# EAGLE design mouthbrain (EAGLE 6.4)

## Sheet 1 of 2
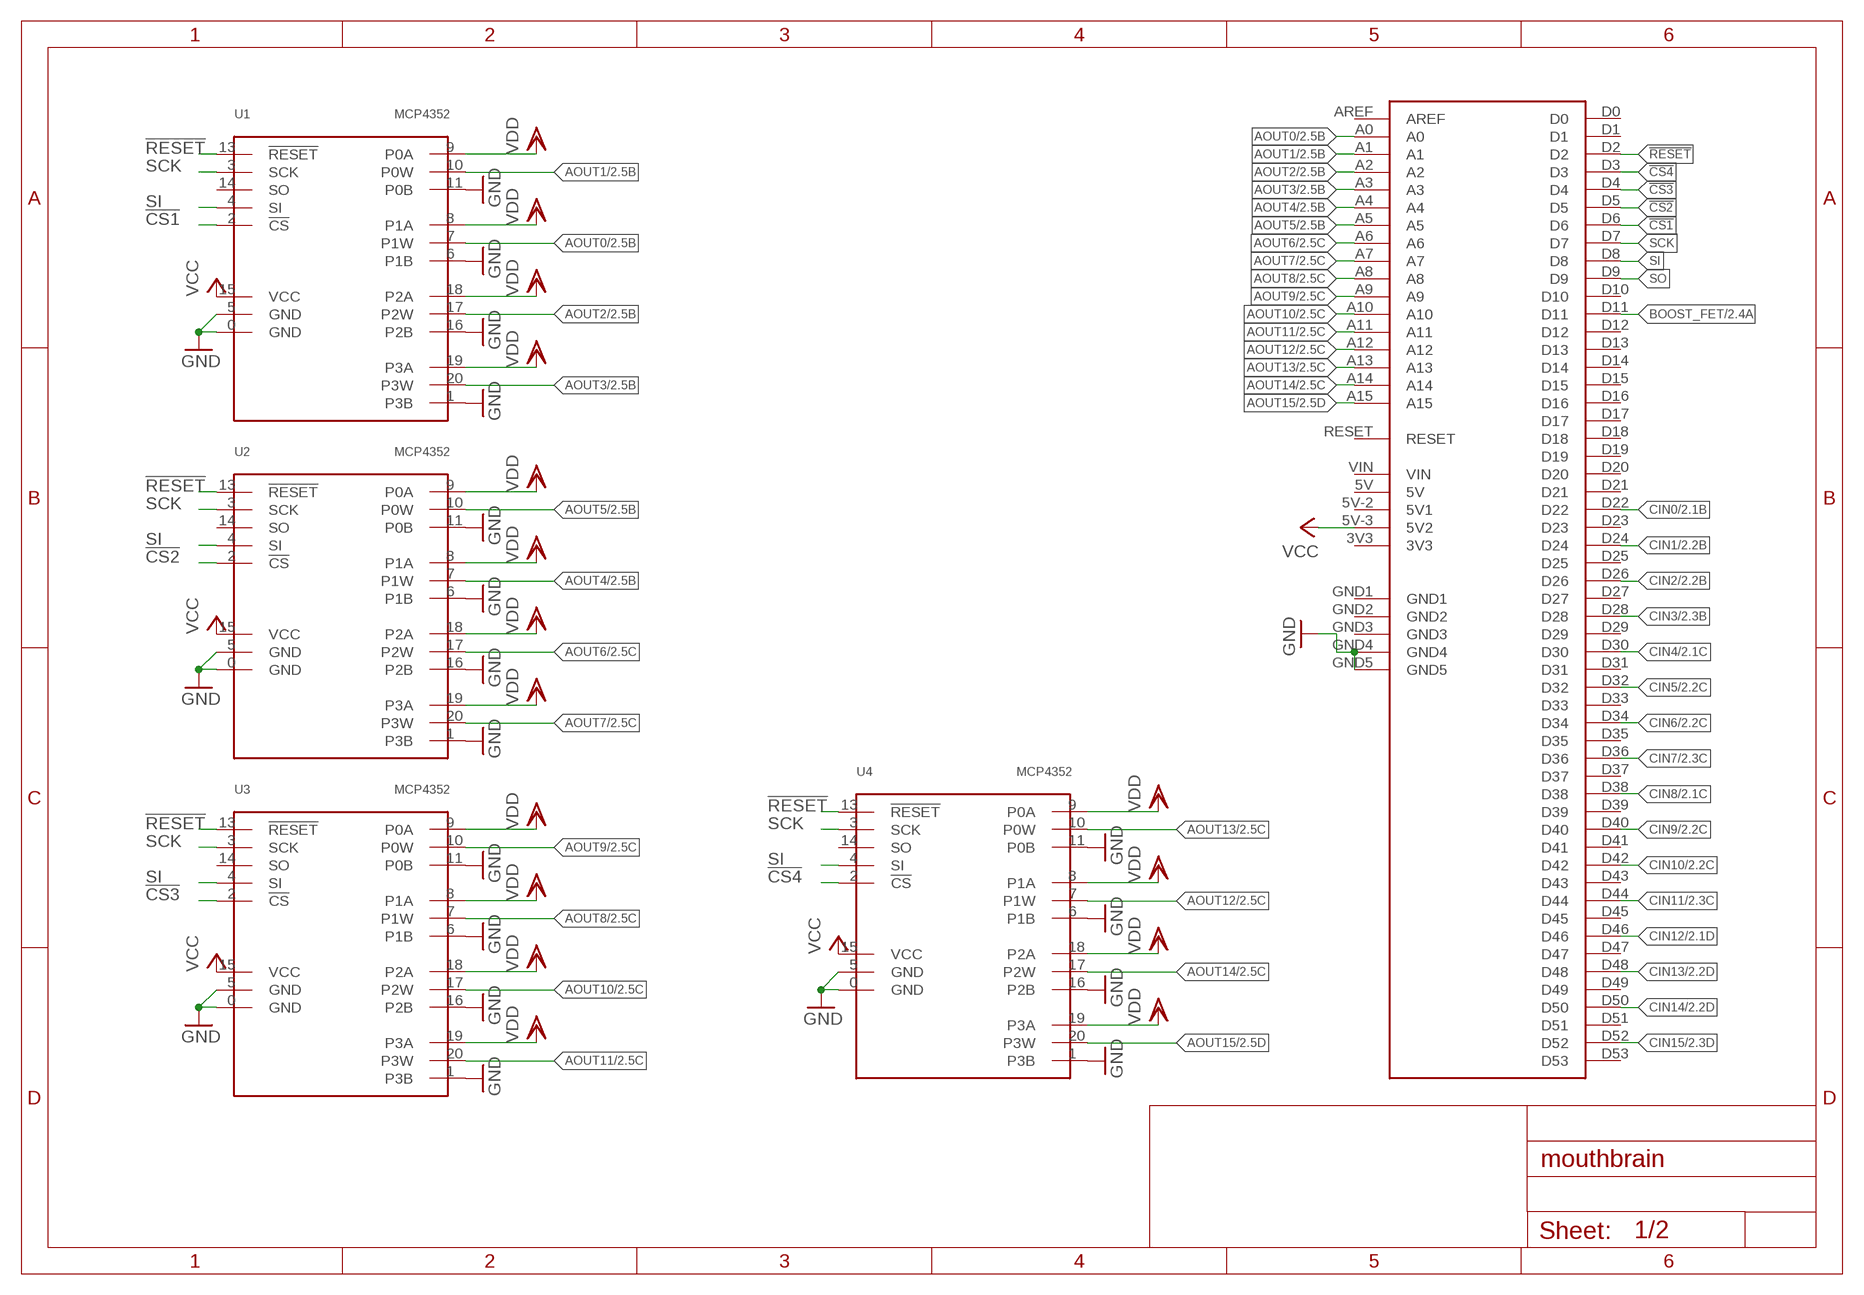
[diagram p0: schematic, sheet 1]

### Parts
U1  MCP4352  [QFN-20-PAD]
U2  MCP4352  [QFN-20-PAD]
U3  MCP4352  [QFN-20-PAD]
U4  MCP4352  [QFN-20-PAD]
U$3  ARDUINO-MEGA  [ARDUINO-MEGA]

### Nets
!CS1: U1.2(!CS) U$3.D6
!CS2: U2.2(!CS) U$3.D5
!CS3: U3.2(!CS) U$3.D4
!CS4: U4.2(!CS) U$3.D3
!RESET: U1.13(!RESET) U2.13(!RESET) U3.13(!RESET) U4.13(!RESET) U$3.D2
AOUT0: U1.7(P1W) U$3.A0 ; also sheet 2
AOUT1: U1.10(P0W) U$3.A1 ; also sheet 2
AOUT2: U1.17(P2W) U$3.A2 ; also sheet 2
AOUT3: U1.20(P3W) U$3.A3 ; also sheet 2
AOUT4: U2.7(P1W) U$3.A4 ; also sheet 2
AOUT5: U2.10(P0W) U$3.A5 ; also sheet 2
AOUT6: U2.17(P2W) U$3.A6 ; also sheet 2
AOUT7: U2.20(P3W) U$3.A7 ; also sheet 2
AOUT8: U3.7(P1W) U$3.A8 ; also sheet 2
AOUT9: U3.10(P0W) U$3.A9 ; also sheet 2
AOUT10: U3.17(P2W) U$3.A10 ; also sheet 2
AOUT11: U3.20(P3W) U$3.A11 ; also sheet 2
AOUT12: U4.7(P1W) U$3.A12 ; also sheet 2
AOUT13: U4.10(P0W) U$3.A13 ; also sheet 2
AOUT14: U4.17(P2W) U$3.A14 ; also sheet 2
AOUT15: U4.20(P3W) U$3.A15 ; also sheet 2
BOOST_FET: U$3.D11 ; also sheet 2
CIN0: U$3.D22 ; also sheet 2
CIN1: U$3.D24 ; also sheet 2
CIN2: U$3.D26 ; also sheet 2
CIN3: U$3.D28 ; also sheet 2
CIN4: U$3.D30 ; also sheet 2
CIN5: U$3.D32 ; also sheet 2
CIN6: U$3.D34 ; also sheet 2
CIN7: U$3.D36 ; also sheet 2
CIN8: U$3.D38 ; also sheet 2
CIN9: U$3.D40 ; also sheet 2
CIN10: U$3.D42 ; also sheet 2
CIN11: U$3.D44 ; also sheet 2
CIN12: U$3.D46 ; also sheet 2
CIN13: U$3.D48 ; also sheet 2
CIN14: U$3.D50 ; also sheet 2
CIN15: U$3.D52 ; also sheet 2
GND: U1.0(GND) U1.1(P3B) U1.5(GND) U1.6(P1B) U1.11(P0B) U1.16(P2B) U2.0(GND) U2.1(P3B) U2.5(GND) U2.6(P1B) U2.11(P0B) U2.16(P2B) U3.0(GND) U3.1(P3B) U3.5(GND) U3.6(P1B) U3.11(P0B) U3.16(P2B) U4.0(GND) U4.1(P3B) U4.5(GND) U4.6(P1B) U4.11(P0B) U4.16(P2B) U$3.GND4 U$3.GND5 ; also sheet 2
SCK: U1.3(SCK) U2.3(SCK) U3.3(SCK) U4.3(SCK) U$3.D7
SI: U1.4(SI) U2.4(SI) U3.4(SI) U4.4(SI) U$3.D8
SO: U$3.D9
VCC: U1.15(VCC) U2.15(VCC) U3.15(VCC) U4.15(VCC) U$3.5V-3(5V2) ; also sheet 2
VDD: U1.8(P1A) U1.9(P0A) U1.18(P2A) U1.19(P3A) U2.8(P1A) U2.9(P0A) U2.18(P2A) U2.19(P3A) U3.8(P1A) U3.9(P0A) U3.18(P2A) U3.19(P3A) U4.8(P1A) U4.9(P0A) U4.18(P2A) U4.19(P3A) ; also sheet 2
Unconnected: U1.14(SO) U2.14(SO) U3.14(SO) U4.14(SO) U$3.3V3 U$3.5V U$3.5V-2(5V1) U$3.AREF U$3.D0 U$3.D1 U$3.D10 U$3.D12 U$3.D13 U$3.D14 U$3.D15 U$3.D16 U$3.D17 U$3.D18 U$3.D19 U$3.D20 U$3.D21 U$3.D23 U$3.D25 U$3.D27 U$3.D29 U$3.D31 U$3.D33 U$3.D35 U$3.D37 U$3.D39 U$3.D41 U$3.D43 U$3.D45 U$3.D47 U$3.D49 U$3.D51 U$3.D53 U$3.GND1 U$3.GND2 U$3.GND3 U$3.RESET U$3.VIN

## Sheet 2 of 2
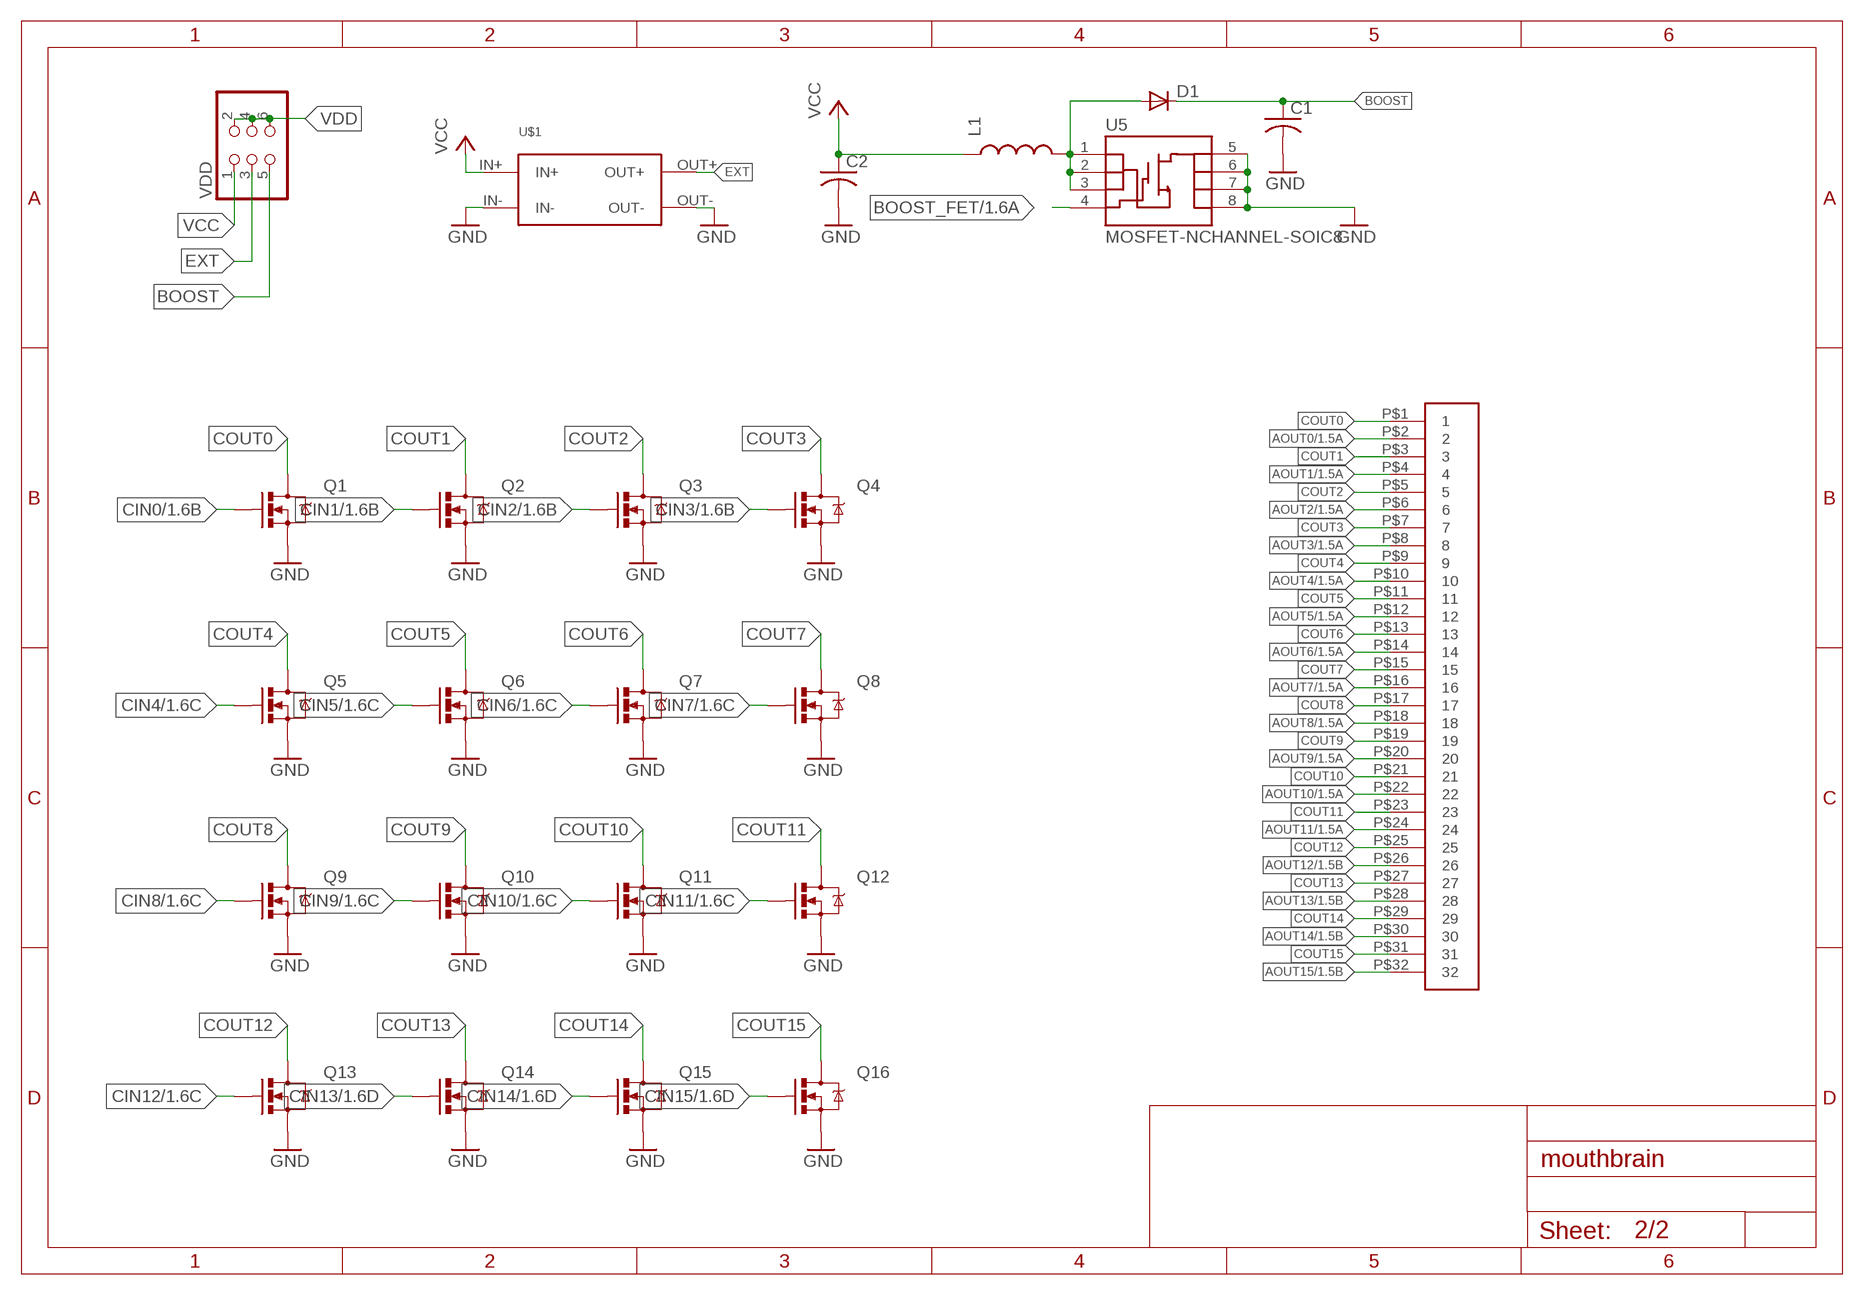
[diagram p1: schematic, sheet 2]

### Parts
C1  C-USC1206  [C1206]
C2  C-USC1206  [C1206]
D1  DIODESMA  [SMA-DIODE]
L1  INDUCTOR1206H*  [INDUCTOR-1206]
Q1  MOSFET-NCHANNELSMD  [SOT23-3]
Q2  MOSFET-NCHANNELSMD  [SOT23-3]
Q3  MOSFET-NCHANNELSMD  [SOT23-3]
Q4  MOSFET-NCHANNELSMD  [SOT23-3]
Q5  MOSFET-NCHANNELSMD  [SOT23-3]
Q6  MOSFET-NCHANNELSMD  [SOT23-3]
Q7  MOSFET-NCHANNELSMD  [SOT23-3]
Q8  MOSFET-NCHANNELSMD  [SOT23-3]
Q9  MOSFET-NCHANNELSMD  [SOT23-3]
Q10  MOSFET-NCHANNELSMD  [SOT23-3]
Q11  MOSFET-NCHANNELSMD  [SOT23-3]
Q12  MOSFET-NCHANNELSMD  [SOT23-3]
Q13  MOSFET-NCHANNELSMD  [SOT23-3]
Q14  MOSFET-NCHANNELSMD  [SOT23-3]
Q15  MOSFET-NCHANNELSMD  [SOT23-3]
Q16  MOSFET-NCHANNELSMD  [SOT23-3]
U5  MOSFET-NCHANNEL-SOIC8  [SO08]
U$1  DC-DC-CONVERTER  [DC-DC-MODULE]
U$2  FPC-0.5-32HORIZ  [FPC-32-HORIZONTAL]
VDD  PINHD-2X3  [2X03]

### Nets
AOUT0: U$2.P$2 ; also sheet 1
AOUT1: U$2.P$4 ; also sheet 1
AOUT2: U$2.P$6 ; also sheet 1
AOUT3: U$2.P$8 ; also sheet 1
AOUT4: U$2.P$10 ; also sheet 1
AOUT5: U$2.P$12 ; also sheet 1
AOUT6: U$2.P$14 ; also sheet 1
AOUT7: U$2.P$16 ; also sheet 1
AOUT8: U$2.P$18 ; also sheet 1
AOUT9: U$2.P$20 ; also sheet 1
AOUT10: U$2.P$22 ; also sheet 1
AOUT11: U$2.P$24 ; also sheet 1
AOUT12: U$2.P$26 ; also sheet 1
AOUT13: U$2.P$28 ; also sheet 1
AOUT14: U$2.P$30 ; also sheet 1
AOUT15: U$2.P$32 ; also sheet 1
BOOST: C1.1 D1.C VDD.5
BOOST_FET: U5.4(G) ; also sheet 1
CIN0: Q1.1(G) ; also sheet 1
CIN1: Q2.1(G) ; also sheet 1
CIN2: Q3.1(G) ; also sheet 1
CIN3: Q4.1(G) ; also sheet 1
CIN4: Q5.1(G) ; also sheet 1
CIN5: Q6.1(G) ; also sheet 1
CIN6: Q7.1(G) ; also sheet 1
CIN7: Q8.1(G) ; also sheet 1
CIN8: Q9.1(G) ; also sheet 1
CIN9: Q10.1(G) ; also sheet 1
CIN10: Q11.1(G) ; also sheet 1
CIN11: Q12.1(G) ; also sheet 1
CIN12: Q13.1(G) ; also sheet 1
CIN13: Q14.1(G) ; also sheet 1
CIN14: Q15.1(G) ; also sheet 1
CIN15: Q16.1(G) ; also sheet 1
COUT0: Q1.3(D) U$2.P$1
COUT1: Q2.3(D) U$2.P$3
COUT2: Q3.3(D) U$2.P$5
COUT3: Q4.3(D) U$2.P$7
COUT4: Q5.3(D) U$2.P$9
COUT5: Q6.3(D) U$2.P$11
COUT6: Q7.3(D) U$2.P$13
COUT7: Q8.3(D) U$2.P$15
COUT8: Q9.3(D) U$2.P$17
COUT9: Q10.3(D) U$2.P$19
COUT10: Q11.3(D) U$2.P$21
COUT11: Q12.3(D) U$2.P$23
COUT12: Q13.3(D) U$2.P$25
COUT13: Q14.3(D) U$2.P$27
COUT14: Q15.3(D) U$2.P$29
COUT15: Q16.3(D) U$2.P$31
EXT: U$1.OUT+ VDD.3
GND: C1.2 C2.2 Q1.2(S) Q2.2(S) Q3.2(S) Q4.2(S) Q5.2(S) Q6.2(S) Q7.2(S) Q8.2(S) Q9.2(S) Q10.2(S) Q11.2(S) Q12.2(S) Q13.2(S) Q14.2(S) Q15.2(S) Q16.2(S) U5.5(D) U5.6(D) U5.7(D) U5.8(D) U$1.IN- U$1.OUT- ; also sheet 1
N$1: D1.A L1.P$2 U5.1(S) U5.2(S) U5.3(S)
VCC: C2.1 L1.P$1 U$1.IN+ VDD.1 ; also sheet 1
VDD: VDD.2 VDD.4 VDD.6 ; also sheet 1

## Library data of the parts
C1 C2 = rcl:C-US: CAPACITOR, American symbol
D1 = SparkFun:DIODE: Diode These are standard reverse protection diodes and small signal diodes. SMA package can handle up to about 1A. SOD-323 can handle about 200mA. What the SOD-323 package when ordering, there are some mfgs out there that are 5-pin packages.
L1 = SparkFun:INDUCTOR: Inductors Basic Inductor/Choke - 0603 and 1206. Footprints are not proven and vary greatly between part numbers.
Q1-Q16 = SparkFun:MOSFET-NCHANNEL
U1-U4 = mouthbrain:MCP4352
U5 = SparkFun:MOSFET-NCHANNEL-SOIC8: N-Channel MOSFET IRF9410 and NDS8434 are common, SOIC-8 parts.
U$1 = Hoektronics:DC-DC-CONVERTER
U$2 = Hoektronics:FPC-0.5-32
U$3 = Hoektronics:ARDUINO-MEGA
VDD = pinhead:PINHD-2X3: PIN HEADER

## Board
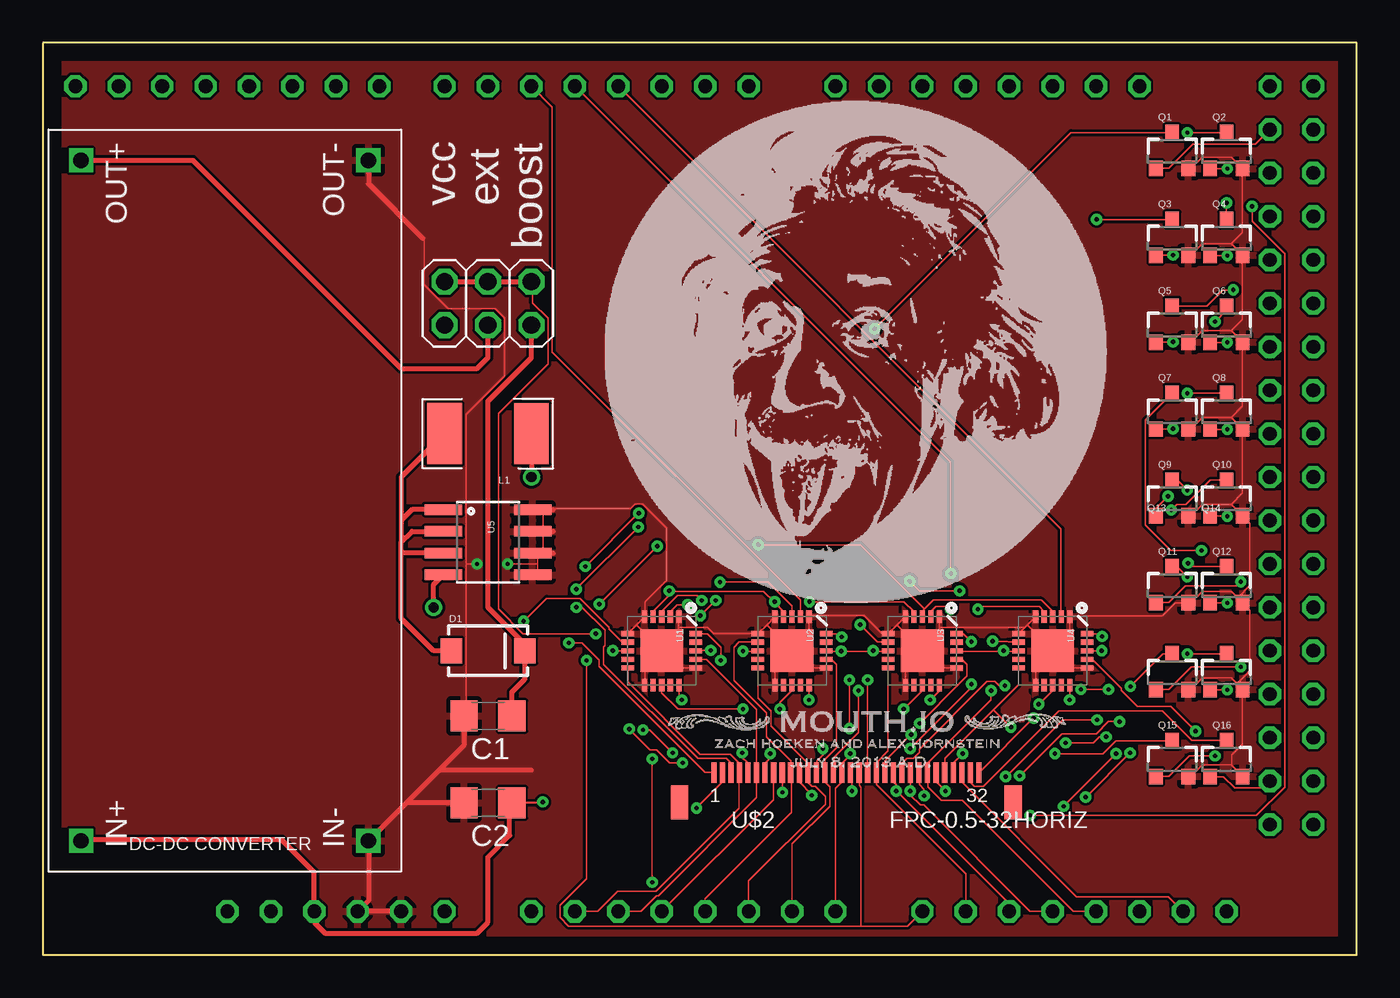
[diagram p2: board, top side]
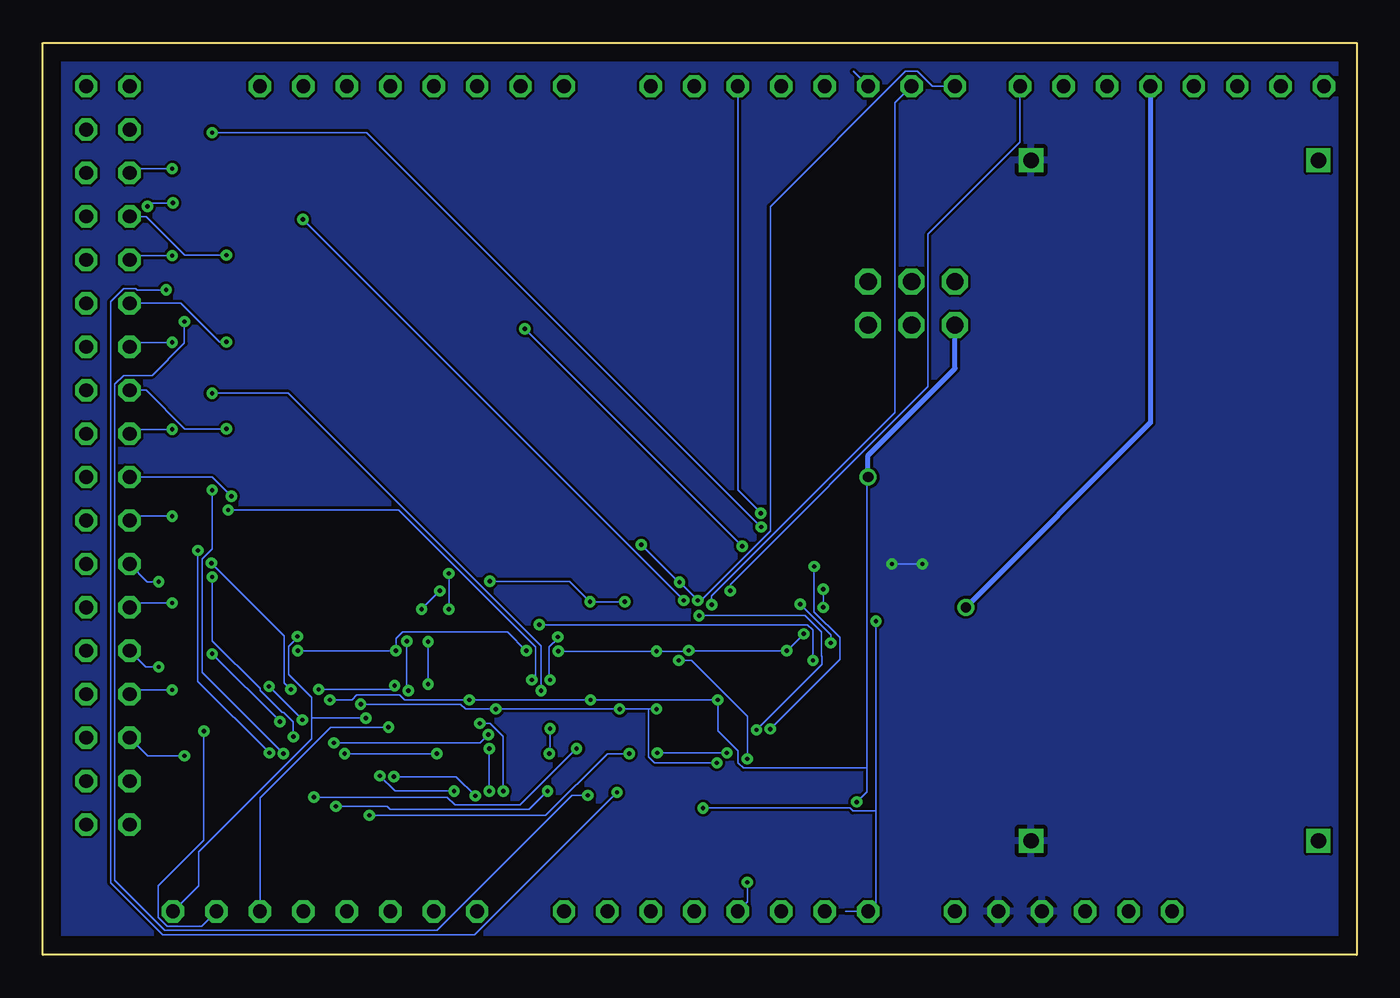
[diagram p3: board, bottom side, seen from below]

Size 76.83 x 53.34 mm. Coordinates in mm from the lower left corner, seen from the top.
Outline: 0,0 76.83,0 76.83,53.34 0,53.34 0,0
Copper layers (1*16): Top 0.035mm / dielectric 1.5mm / Bottom 0.035mm
Design rules "default *": minimum track width 4mil, minimum drill 10mil, track to track 6mil, track to pad 6mil, pad to pad 6mil, via to via 6mil, smd to smd 6mil, copper to edge 40mil, drill to drill 8mil, minimum pad ring 10mil, minimum via ring 8mil, stop-mask expansion 4mil, vias tented up to drill 15mil, thermal gap 10mil

### Footprints (pad centres in the part's own frame; a part is rotated, then mirrored left to right if it is on the bottom)
C1206 = smd 1.6 x 1.8: 1 -1.4,0; 2 1.4,0
SMA-DIODE = smd 1.27 x 1.47: A -2.15,0; C 2.15,0
INDUCTOR-1206 = smd 2.032 x 3.556: P$1 -2.54,0; P$2 2.54,0
SOT23-3 = smd 0.8 x 0.9: 1 -0.95,-1; 2 0.95,-1; 3 0,1.1
QFN-20-PAD = smd 2.5 x 2.5: 0 0,0 | smd 0.73 x 0.3: 1 -2,1; 2 -2,0.5; 3 -2,0; 4 -2,-0.5; 5 -2,-1; 11 2,-1; 12 2,-0.5; 13 2,0; 14 2,0.5; 15 2,1 | smd 0.3 x 0.73: 6 -1,-2; 7 -0.5,-2; 8 0,-2; 9 0.5,-2; 10 1,-2; 16 1,2; 17 0.5,2; 18 0,2; 19 -0.5,2; 20 -1,2
SO08 = smd 0.61 x 2.21: 1 -1.905,-2.616; 2 -0.635,-2.616; 3 0.635,-2.616; 4 1.905,-2.616; 5 1.905,2.616; 6 0.635,2.616; 7 -0.635,2.616; 8 -1.905,2.616
DC-DC-MODULE = drill 0.9 square: IN+ -19.9,8.4; IN- -19.9,-8.4; OUT+ 19.9,8.4; OUT- 19.9,-8.4
FPC-32-HORIZONTAL = smd 0.3 x 1.2: P$1 -7.75,0.5; P$2 -7.25,0.5; P$3 -6.75,0.5; P$4 -6.25,0.5; P$5 -5.75,0.5; P$6 -5.25,0.5; P$7 -4.75,0.5; P$8 -4.25,0.5; P$9 -3.75,0.5; P$10 -3.25,0.5; P$11 -2.75,0.5; P$12 -2.25,0.5; P$13 -1.75,0.5; P$14 -1.25,0.5; P$15 -0.75,0.5; P$16 -0.25,0.5; P$17 0.25,0.5; P$18 0.75,0.5; P$19 1.25,0.5; P$20 1.75,0.5; P$21 2.25,0.5; P$22 2.75,0.5; P$23 3.25,0.5; P$24 3.75,0.5; P$25 4.25,0.5; P$26 4.75,0.5; P$27 5.25,0.5; P$28 5.75,0.5; P$29 6.25,0.5; P$30 6.75,0.5; P$31 7.25,0.5; P$32 7.75,0.5 | smd 1 x 2: P$33 -9.75,-1.25; P$34 9.75,-1.25
ARDUINO-MEGA = drill 0.8 octagon: 3V3 35.56,2.54; 5V 93.98,50.8; 5V-2 96.52,50.8; 5V-3 38.1,2.54; A0 50.8,2.54; A1 53.34,2.54; A2 55.88,2.54; A3 58.42,2.54; A4 60.96,2.54; A5 63.5,2.54; A6 66.04,2.54; A7 68.58,2.54; A8 73.66,2.54; A9 76.2,2.54; A10 78.74,2.54; A11 81.28,2.54; A12 83.82,2.54; A13 86.36,2.54; A14 88.9,2.54; A15 91.44,2.54; AREF 24.13,50.8; D0 63.5,50.8; D1 60.96,50.8; D2 58.42,50.8; D3 55.88,50.8; D4 53.34,50.8; D5 50.8,50.8; D6 48.26,50.8; D7 45.72,50.8; D8 41.91,50.8; D9 39.37,50.8; D10 36.83,50.8; D11 34.29,50.8; D12 31.75,50.8; D13 29.21,50.8; D14 68.58,50.8; D15 71.12,50.8; D16 73.66,50.8; D17 76.2,50.8; D18 78.74,50.8; D19 81.28,50.8; D20 83.82,50.8; D21 86.36,50.8; D22 93.98,48.26; D23 96.52,48.26; D24 93.98,45.72; D25 96.52,45.72; D26 93.98,43.18; D27 96.52,43.18; D28 93.98,40.64; D29 96.52,40.64; D30 93.98,38.1; D31 96.52,38.1; D32 93.98,35.56; D33 96.52,35.56; D34 93.98,33.02; D35 96.52,33.02; D36 93.98,30.48; D37 96.52,30.48; D38 93.98,27.94; D39 96.52,27.94; D40 93.98,25.4; D41 96.52,25.4; D42 93.98,22.86; D43 96.52,22.86; D44 93.98,20.32; D45 96.52,20.32; D46 93.98,17.78; D47 96.52,17.78; D48 93.98,15.24; D49 96.52,15.24; D50 93.98,12.7; D51 96.52,12.7; D52 93.98,10.16; D53 96.52,10.16; GND1 26.67,50.8; GND2 93.98,7.62; GND3 96.52,7.62; GND4 40.64,2.54; GND5 43.18,2.54; RESET 33.02,2.54; VIN 45.72,2.54
2X03 = drill 1.016 octagon: 1 -2.54,-1.27; 2 -2.54,1.27; 3 0,-1.27; 4 0,1.27; 5 2.54,-1.27; 6 2.54,1.27

### Placement (x,y rotation side)
C1  26.04,13.97 180 top
C2  26.04,8.89 180 top
D1  26.04,17.78 0 top
L1  26.04,30.48 180 top
Q1  66.04,46.99 0 top
Q2  69.22,46.99 0 top
Q3  66.04,41.91 0 top
Q4  69.22,41.91 0 top
Q5  66.04,36.83 0 top
Q6  69.22,36.83 0 top
Q7  66.04,31.75 0 top
Q8  69.22,31.75 0 top
Q9  66.04,26.67 0 top
Q10  69.22,26.67 0 top
Q11  66.04,21.59 0 top
Q12  69.22,21.59 0 top
Q13  66.04,16.51 0 top
Q14  69.22,16.51 0 top
Q15  66.04,11.43 0 top
Q16  69.22,11.43 0 top
U1  36.2,17.78 270 top
U2  43.81,17.78 270 top
U3  51.44,17.78 270 top
U4  59.05,17.78 270 top
U5  26.04,24.13 270 top
U$1  10.64,26.57 90 top
U$2  46.99,10.16 0 top
U$3  -22.23,0 0 top
VDD  26.04,38.1 0 top

### Tracks (layer width: path | path; a pad name or v marks a point on that pad's centre or on a via)
!CS1  (via drill 0.25)
  Top 0.102: v37.72,20.47 37.08,20.47 36.7,20.09 U1.2
  Bottom 0.102: v37.72,20.47 37.72,20.98 27,31.7 27,49.84 U$3.D6
!CS2
  Top 0.102: U$3.D5 29.79,49.58 29.79,35.26 44.3,20.75 44.3,19.79 U2.2
  Bottom 0.102: U$3.D5 29.44,51.66
!CS3  (via drill 0.25)
  Top 0.102: v53.09,20.22 52.93,20.37 52.22,20.37 51.94,20.09 U3.2 | v53.09,22.3 53.09,28.83 U$3.D4
  Bottom 0.102: v53.09,22.3 v53.09,20.22
!CS4
  Top 0.102: U$3.D3 59.54,24.92 59.54,19.79 U4.2
!RESET  (via drill 0.25)
  Top 0.102: U1.13 36.2,15.32 37.13,14.38 v40.95,14.38 | v43.1,14.38 43.1,14.76 43.81,15.47 U2.13 | U3.13 51.44,15.47 v50.34,14.38 | U4.13 59.05,15.47 v58.24,14.66 | v31.73,22.71 v34.85,25.83 | v34.29,13.21 35.51,11.99 35.89,11.99 36.65,11.23 v37.41,11.23
  Bottom 0.102: 41.43,14.38 v43.1,14.38 v50.34,14.38 52.12,14.38 52.4,14.66 v58.24,14.66 | 41.43,14.38 v40.95,14.38 | U$3.D2 36.2,27.18 v34.85,25.83 | v31.73,22.71 31.73,20.07 30.23,18.57 30.23,17.27 v34.29,13.21 | v37.41,11.23 41.07,11.23 41.43,11.58 41.43,14.38
AOUT0  (via drill 0.25)
  Top 0.102: v28.12,19.51 29.46,20.85 31.42,20.85 33.12,19.15 33.12,19.05 33.88,18.29 34.19,18.29 U1.7 | v38.23,8.59 39.73,10.08 39.73,10.64 U$2.P$2
  Bottom 0.102: 29.9,2.54 U$3.A0 28.12,3 28.12,8.41 | 28.12,8.41 v28.12,19.51 | v38.23,8.59 29.64,8.59 29.46,8.41 28.12,8.41
AOUT1
  Top 0.102: U1.10 34.21,16.76 34.21,15.95 38.43,11.73 40.21,11.73 40.72,11.23 40.72,10.67 U$2.P$4 40.72,10.62 40.72,8.56 35.87,3.71 33.6,3.71 32.44,2.54 U$3.A1
AOUT2
  Top 0.102: U1.17 38.81,17.27 41.73,14.35 U$2.P$6 41.73,10.62 41.73,9.2 35.99,3.45 35.89,3.45 34.98,2.54 U$3.A2
AOUT3  (via drill 0.25)
  Top 0.102: v39.65,17.22 39.65,17.98 38.86,18.77 U1.20 | v35.64,4.24 v35.64,11.46 | U$3.A3 42.72,9.07 42.72,10.64 U$2.P$8
  Bottom 0.102: v39.65,17.22 38.91,17.22 35.64,13.95 v35.64,11.46 | v35.64,4.24 35.64,3.1 U$3.A3
AOUT4
  Top 0.102: U2.7 40.72,18.29 40.41,17.98 40.41,16.05 42.32,14.15 42.32,12.75 43.74,11.33 U$2.P$10 43.79,10.64 43.79,8.33 38.73,3.28 U$3.A4
AOUT5
  Top 0.102: U2.10 41.83,16.76 41.83,15.01 42.57,14.28 42.57,13.39 44.73,11.23 44.73,10.67 U$2.P$12 44.76,10.62 44.76,10.08 44.98,9.86 45.19,9.86 45.77,9.27 45.77,8.81 41.27,4.32 U$3.A5
AOUT6
  Top 0.102: U2.17 45.82,17.27 46.13,17.27 46.41,16.99 46.41,12.09 45.74,11.43 U$2.P$14 45.77,10.62 45.77,10.08 46.02,9.83 46.02,8.69 43.81,6.48 U$3.A6
AOUT7  (via drill 0.25)
  Top 0.102: v46.71,18.59 46.53,18.77 45.82,18.77 U2.20 | v47.17,13.23 v47.17,16.08 | v47.22,11.76 47.22,11.68 46.76,11.23 46.76,10.67 U$2.P$16 46.74,10.62 46.74,10.11 46.35,9.73 U$3.A7
  Bottom 0.102: v46.71,18.59 46.71,18.52 47.22,18.01 47.22,16.13 v47.17,16.08 | v47.17,13.23 47.17,11.81 v47.22,11.76
AOUT8  (via drill 0.25)
  Top 0.102: v47.8,19.3 48.82,18.29 49.43,18.29 U3.7 | v31.8,17.22 31.8,4.45 30.25,2.9 30.25,2.18 30.76,1.68 47.85,1.68 | 47.85,1.68 50.57,1.68 U$3.A8 | 47.85,1.68 47.85,9.8 47.75,9.91 47.75,10.64 U$2.P$18
  Bottom 0.102: v47.8,19.3 32.11,19.3 31.8,19 v31.8,17.22
AOUT9
  Top 0.102: U3.10 49.43,16.76 49.43,11.91 48.74,11.23 U$2.P$20 48.74,10.62 48.74,9.98 53.98,4.75 U$3.A9
AOUT10  (via drill 0.25)
  Top 0.102: v51.28,13.54 52.43,14.68 52.43,14.71 54.03,16.31 54.03,16.99 53.75,17.27 U3.17 | U$2.P$22 49.76,10.64 49.76,10.08 49.91,9.93 v49.91,9.58 56.52,2.97 U$3.A10
  Bottom 0.102: v51.28,13.54 50.67,13.54 49.91,12.78 v49.91,9.58
AOUT11  (via drill 0.25)
  Top 0.102: v54.3,18.31 53.85,18.77 U3.20 | v54.3,15.82 54.3,15.65 v50.72,12.06 | U$2.P$24 50.72,10.64 v50.72,9.58 50.75,9.55 50.75,9.32 51.31,8.76 51.51,8.76 57.73,2.54 U$3.A11
  Bottom 0.102: v54.3,15.82 v54.3,18.31 | v50.72,9.58 v50.72,12.06
AOUT12  (via drill 0.25)
  Top 0.102: v55.55,18.34 56.41,18.34 56.46,18.29 U4.7 | v55.45,15.44 55.45,14.91 51.77,11.23 51.77,10.67 U$2.P$26 51.77,10.62 51.77,9.83 52.55,9.04 53.77,9.04 60.27,2.54 U$3.A12
  Bottom 0.102: v55.55,18.34 55.55,15.54 v55.45,15.44
AOUT13  (via drill 0.25)
  Top 0.102: 55.6,14.33 52.76,11.48 52.76,10.67 U$2.P$28 | 55.6,14.33 57.05,15.77 57.05,16.76 U4.10 | 55.6,14.33 v56.62,13.31
  Bottom 0.102: U$3.A13 64.14,9.17 59.99,13.31 v56.62,13.31
AOUT14  (via drill 0.25)
  Top 0.102: v67.41,13.08 65.96,14.53 64.01,14.53 63.07,15.47 63.07,15.57 61.37,17.27 61.06,17.27 U4.17 | U$3.A14 65.81,3.4 60.45,3.4 53.75,10.11 53.75,10.64 U$2.P$30
  Bottom 0.102: v67.41,13.08 67.41,6.71 70.08,4.04 70.08,2.18 69.57,1.68 67.54,1.68 U$3.A14
AOUT15  (via drill 0.25)
  Top 0.102: v61.95,18.62 61.8,18.77 61.06,18.77 U4.20 | v57.94,13.84 54.76,10.67 U$2.P$32
  Bottom 0.102: v61.95,18.62 61.95,18.54 62.46,18.03 62.46,16.41 61.11,15.06 61.11,13.84 | 61.11,13.84 61.11,12.62 67.72,6.02 67.72,4.04 U$3.A15 | 61.11,13.84 v57.94,13.84
BOOST
  Top 0.305: C1.1 27.43,15.37 28.18,16.12 D1.C 28.18,18.17 26.04,20.32 26.04,32.38 28.57,34.92 VDD.5
BOOST_FET  (via drill 0.6)
  Top 0.305: v22.86,20.32 22.86,21.67 U5.4
  Bottom 0.305: U$3.D11 12.06,31.11 v22.86,20.32
CIN0
  Top 0.102: U$3.D22 70.92,47.42 67.26,47.42 65.84,46 Q1.1
CIN1  (via drill 0.25)
  Top 0.102: v69.27,45.97 68.28,45.97 Q2.1
  Bottom 0.102: v69.27,45.97 71.5,45.97 U$3.D24
CIN2  (via drill 0.25)
  Top 0.102: v66.09,40.92 Q3.1
  Bottom 0.102: v66.09,40.92 68.53,40.92 70.79,43.18 U$3.D26
CIN3  (via drill 0.25)
  Top 0.102: v69.27,40.89 68.28,40.89 Q4.1
  Bottom 0.102: v69.27,40.89 71.5,40.89 U$3.D28
CIN4  (via drill 0.25)
  Top 0.102: v66.09,35.84 Q5.1
  Bottom 0.102: v66.09,35.84 66.5,35.84 68.76,38.1 U$3.D30
CIN5  (via drill 0.25)
  Top 0.102: v69.27,35.81 68.28,35.81 Q6.1
  Bottom 0.102: v69.27,35.81 71.5,35.81 U$3.D32
CIN6  (via drill 0.25)
  Top 0.102: v66.09,30.76 Q7.1
  Bottom 0.102: v66.09,30.76 68.53,30.76 70.79,33.02 U$3.D34
CIN7  (via drill 0.25)
  Top 0.102: v69.27,30.73 68.28,30.73 Q8.1
  Bottom 0.102: v69.27,30.73 71.5,30.73 U$3.D36
CIN8  (via drill 0.25)
  Top 0.102: v65.81,26.82 65.1,26.11 Q9.1
  Bottom 0.102: v65.81,26.82 66.93,27.94 U$3.D38
CIN9  (via drill 0.25)
  Top 0.102: v69.27,25.65 68.28,25.65 Q10.1
  Bottom 0.102: v69.27,25.65 71.5,25.65 U$3.D40
CIN10  (via drill 0.25)
  Top 0.102: v70.05,21.82 69.8,21.57 66.8,21.57 65.84,20.6 Q11.1
  Bottom 0.102: v70.05,21.82 70.71,21.82 U$3.D42
CIN11  (via drill 0.25)
  Top 0.102: v69.27,20.57 68.28,20.57 Q12.1
  Bottom 0.102: v69.27,20.57 71.5,20.57 U$3.D44
CIN12  (via drill 0.25)
  Top 0.102: v70.05,16.84 67.16,16.84 65.84,15.52 Q13.1
  Bottom 0.102: v70.05,16.84 70.81,16.84 U$3.D46
CIN13  (via drill 0.25)
  Top 0.102: v69.27,15.49 68.28,15.49 Q14.1
  Bottom 0.102: v69.27,15.49 71.5,15.49 U$3.D48
CIN14  (via drill 0.25)
  Top 0.102: v68.56,11.63 67.03,11.63 65.84,10.44 Q15.1
  Bottom 0.102: v68.56,11.63 70.69,11.63 U$3.D50
CIN15
  Top 0.102: U$3.D52 71.35,9.75 69.7,9.75 69.04,10.41 68.28,10.41 Q16.1
COUT0  (via drill 0.25)
  Top 0.102: v48.64,36.6 60.12,48.08 Q1.3 | v32.54,20.5 v35.94,23.9 | v30.76,18.24 31.55,18.24 32.54,17.25 32.54,16.87 38.73,10.67 39.22,10.67 U$2.P$1
  Bottom 0.102: v35.94,23.9 v48.64,36.6 | v32.54,20.5 30.76,18.72 v30.76,18.24
COUT1  (via drill 0.25)
  Top 0.102: v66.93,48.08 Q2.3 | v31.19,21.39 v34.82,25.02 | v31.19,20.32 31.55,20.32 32.87,19 32.87,18.09 32.79,18.01 32.79,16.99 38.3,11.48 39.98,11.48 40.23,11.23 U$2.P$3
  Bottom 0.102: v66.93,48.08 57.89,48.08 v34.82,25.02 | v31.19,20.32 v31.19,21.39
COUT2  (via drill 0.25)
  Top 0.102: v61.62,43 Q3.3 | v38.46,19.84 v39.34,20.73 | v35.1,13.16 35.48,13.16 v36.83,11.81 | v40.89,11.81 40.89,11.56 41.22,11.23 41.22,10.67 U$2.P$5
  Bottom 0.102: v39.34,20.73 v61.62,43 | v38.46,19.84 32.26,19.84 31.29,18.87 31.29,17.48 31.27,17.45 31.27,16.99 v35.1,13.16 | v40.89,11.81 v36.83,11.81
COUT3  (via drill 0.25)
  Top 0.102: v69.22,43.97 Q4.3 | v70.71,43.76 70.71,42.9 72.62,41 72.62,9.8 70.97,8.15 v57.73,8.15 | v42.55,11.76 42.55,11.51 42.24,11.2 U$2.P$7
  Bottom 0.102: v69.22,43.97 70.51,43.97 v70.71,43.76 | v57.73,8.15 47.42,8.15 43.81,11.76 v42.55,11.76
COUT4  (via drill 0.25)
  Top 0.102: v69.62,38.89 69.01,38.89 68.07,37.95 66.04,37.95 Q5.3 | v43.26,9.5 43.26,10.64 U$2.P$9
  Bottom 0.102: v69.62,38.89 71.32,38.89 71.4,38.96 72.11,38.96 72.87,38.2 72.87,4.22 69.83,1.17 51.59,1.17 v43.26,9.5
COUT5  (via drill 0.25)
  Top 0.102: Q6.3 69.22,37.69 v68.56,37.03 | v44.96,9.32 44.96,9.4 44.25,10.11 44.25,10.64 U$2.P$11
  Bottom 0.102: v68.56,37.03 68.56,35.76 70.43,33.88 72.11,33.88 72.62,33.38 72.62,4.34 69.7,1.42 53.77,1.42 45.87,9.32 v44.96,9.32
COUT6  (via drill 0.25)
  Top 0.102: v67.77,23.65 65.96,23.65 64.47,25.15 64.47,31.27 Q7.3 | v60.98,9.22 v63.58,11.81 | v45.62,12.06 45.62,11.68 45.26,11.33 45.26,10.67 U$2.P$13
  Bottom 0.102: v67.77,23.65 67.77,16 v63.58,11.81 | v60.98,9.22 53.19,9.22 52.73,8.76 48.92,8.76 v45.62,12.06
COUT7  (via drill 0.25)
  Top 0.102: v66.93,32.84 Q8.3 | v47.7,15.44 47.7,13.01 46.25,11.56 46.25,10.67 U$2.P$15
  Bottom 0.102: v66.93,32.84 62.48,32.84 47.7,18.06 v47.7,15.44
COUT8  (via drill 0.25)
  Top 0.102: v66.93,27.18 66.34,27.76 Q9.3 | v59.69,8.69 v62.76,11.76 | v47.32,9.58 47.32,10.57 47.24,10.64 U$2.P$17
  Bottom 0.102: v66.93,27.18 66.93,23.72 67.51,23.14 67.51,16.51 v62.76,11.76 | v59.69,8.69 56.69,8.69 56.52,8.51 48.39,8.51 v47.32,9.58
COUT9  (via drill 0.25)
  Top 0.102: v65.99,26.01 66.32,26.34 66.85,26.34 68.28,27.76 Q10.3 | v48.23,16.08 U$2.P$19
  Bottom 0.102: v65.99,26.01 56.03,26.01 48.03,18.01 48.03,16.28 v48.23,16.08
COUT10  (via drill 0.25)
  Top 0.102: v66.93,22.1 66.34,22.68 Q11.3 | v62.18,12.75 61.8,12.75 61.44,12.39 v59.82,12.39 | v50.77,12.88 49.25,11.35 U$2.P$21
  Bottom 0.102: v66.93,22.1 66.93,18.36 64.14,15.57 64.14,15.47 62.84,14.17 62.74,14.17 62.18,13.61 v62.18,12.75 | v59.82,12.39 51.26,12.39 v50.77,12.88
COUT11  (via drill 0.25)
  Top 0.102: v66.98,22.91 67.18,22.71 69.22,22.71 Q12.3 | v60.71,15.52 v62.33,15.52 | v56.26,15.75 55.91,15.75 55.68,15.98 55.22,15.98 51.26,12.01 51.26,11.84 50.9,11.48 50.52,11.48 50.24,11.2 U$2.P$23
  Bottom 0.102: v66.98,22.91 62.71,18.64 62.71,15.9 v62.33,15.52 | v60.71,15.52 56.49,15.52 v56.26,15.75
COUT12  (via drill 0.25)
  Top 0.102: v63.6,15.7 65.51,17.6 Q13.3 | v61.65,13.74 59.64,13.74 v56.31,10.41 | v51.54,9.3 51.54,9.68 51.26,9.96 51.26,10.64 U$2.P$25
  Bottom 0.102: v61.65,13.74 v63.6,15.7 | v56.31,10.41 52.65,10.41 v51.54,9.3
COUT13  (via drill 0.25)
  Top 0.102: v66.93,17.6 Q14.3 | v62.97,13.64 62.31,13.64 61.59,12.93 59.59,12.93 v57.12,10.46 | v52.78,9.58 52.25,10.11 52.25,10.64 U$2.P$27
  Bottom 0.102: v62.97,13.64 v66.93,17.6 | v57.12,10.46 56.24,9.58 v52.78,9.58
COUT14  (via drill 0.25)
  Top 0.102: v59.18,11.76 62,11.76 62.76,12.52 Q15.3 | v53.8,11.76 53.26,11.23 53.26,10.67 U$2.P$29
  Bottom 0.102: v53.8,11.76 v59.18,11.76
COUT15
  Top 0.102: Q16.3 69.22,12.55 67.18,12.55 65.46,14.28 59.41,14.28 54.99,9.86 54.48,9.86 54.25,10.08 54.25,10.64 U$2.P$31
EXT
  Top 0.305: U$1.OUT+ 8.78,46.47 20.95,34.29 25.4,34.29 26.04,34.92 VDD.3
GND  (via drill 0.25)
  Top 0.102: 69.49,11.1 67.79,11.1 67.13,10.44 67,10.44 Q15.2 | 69.49,11.1 70.16,10.44 Q16.2 | Q13.2 67,15.52 67.13,15.52 67.79,16.18 69.49,16.18 70.16,15.52 Q14.2 | 69.49,11.1 69.52,11.12 69.52,11.68 70.16,12.32 70.16,15.47 Q14.2 | Q1.2 67,46 67.13,46 67.79,46.66 69.49,46.66 70.16,46 Q2.2 70.16,45.95 70.16,42.24 69.49,41.58 | 69.49,41.58 67.79,41.58 67.13,40.92 67,40.92 Q3.2 | 69.49,41.58 70.16,40.92 Q4.2 70.16,40.87 70.16,37.16 69.49,36.5 | 69.49,36.5 67.79,36.5 67.13,35.84 67,35.84 Q5.2 | 69.49,36.5 70.16,35.84 Q6.2 70.16,35.79 70.16,32.08 69.49,31.42 | 69.49,31.42 67.79,31.42 67.13,30.76 67,30.76 Q7.2 | 69.49,31.42 70.16,30.76 Q8.2 70.16,30.71 70.16,27 69.49,26.34 | Q12.2 70.16,20.6 69.49,21.26 67.79,21.26 67.13,20.6 67,20.6 Q11.2 66.95,20.57 66.22,20.57 65.46,19.81 60.1,19.81 U4.1 60.05,19.76 60.05,18.77 U4.0 | 69.49,26.34 67.79,26.34 67.13,25.68 67,25.68 Q9.2 | 69.49,26.34 70.16,25.68 Q10.2 70.18,25.63 70.59,25.22 70.59,21.59 69.9,20.9 Q12.2 | Q14.2 69.85,15.88 70.59,16.61 70.59,20.14 70.18,20.55 Q12.2 | 24.74,22.86 24.74,14.07 C1.2 | 24.74,22.86 24.74,31.6 27,33.86 27,37.24 26.44,37.8 23.7,37.8 22.3,39.19 22.3,41.78 22.23,41.91 | 49.96,19.3 50.42,19.76 U3.5 | 49.96,19.3 49.45,18.8 U3.6 49.4,18.8 49.07,18.8 48.03,19.84 44.88,19.84 44.86,19.81 U2.1 44.81,19.76 44.81,18.77 U2.0 | U3.0 50.44,16.79 50.44,15.8 U3.11 | U3.0 52.43,16.79 53.42,16.79 U3.16 | 52.43,19.15 52.43,18.77 U3.0 | 52.43,19.15 52.43,19.76 U3.1 | 49.96,19.3 51.44,17.83 U3.0 | 57.58,19.3 58.04,19.76 U4.5 | 57.58,19.3 57.4,19.13 | 57.4,19.13 57.07,18.8 U4.6 | U4.0 58.06,16.79 58.06,15.8 U4.11 | U4.0 60.05,16.79 61.04,16.79 U4.16
  Top 0.102: 57.58,19.3 59.05,17.83 U4.0 | 52.43,19.15 57.38,19.15 57.4,19.13 | 42.34,19.3 42.8,19.76 U2.5 | 42.34,19.3 41.83,18.8 U2.6 41.78,18.8 39.22,18.8 38.86,19.15 37.19,19.15 | U2.0 42.82,16.79 42.82,15.8 U2.11 | U2.0 44.81,16.79 45.8,16.79 U2.16 | 42.34,19.3 43.81,17.83 U2.0 | 28.93,22.86 28.93,23.37 U5.6 29.26,23.62 29.26,24.64 U5.7 29.26,24.89 29.26,25.91 U5.8 | 28.93,22.86 28.93,22.35 U5.5 | 34.72,19.3 35.18,19.76 U1.5 35.23,19.81 35.23,20.65 36.47,21.89 36.47,24.97 35.08,26.36 34.62,26.36 34.37,26.11 29.97,26.11 29.84,26.04 | 34.72,19.3 34.21,18.8 U1.6 | U1.0 35.2,16.79 35.2,15.8 U1.11 | U1.0 37.19,16.79 38.18,16.79 U1.16 | 37.19,19.15 37.19,18.77 U1.0 | 37.19,19.15 37.19,19.76 U1.1 | 34.72,19.3 36.2,17.83 U1.0 | v25.4,22.86 24.74,22.86 | 28.93,22.86 v27.18,22.86
  Top 0.305: U$3.GND5 U$3.GND4 19.04,3.17 U$1.IN- 21.26,8.89 | C2.2 21.26,8.89 | U5.5 29.21,22.23 | 28.57,10.79 23.17,10.79 | 23.17,10.79 21.26,8.89 | C1.2 24.64,12.26 23.17,10.79 | U5.6 29.84,23.5 | U5.7 29.84,24.77 | U5.8 29.84,26.04 | U$1.OUT- 19.04,46.36 19.05,46.35 19.05,45.09 22.23,41.91
  Bottom 0.102: v27.18,22.86 v25.4,22.86
  pour Bottom: -1.27,54.61 77.47,54.61 77.47,-1.27 -1.27,-1.27
  pour Top: -1.27,54.61 77.47,54.61 77.47,-1.27 -1.27,-1.27
N$1
  Top 0.305: D1.A 22.86,17.78 20.95,19.68 20.95,23.5 | 20.95,23.5 20.95,24.13 | 20.95,24.13 21.59,24.77 U5.2 | U5.3 20.95,23.5 | U5.1 21.59,26.04 20.95,25.4 | 20.95,25.4 20.95,24.13 | L1.P$2 20.95,27.94 20.95,25.4
SCK  (via drill 0.25)
  Top 0.102: U3.3 51.44,20.09 51.56,20.22 | 51.56,20.22 52.09,20.75 58.4,20.75 59.05,20.09 U4.3 | U1.3 36.2,20.09 37.11,21.01 38.25,21.01 v38.53,20.73 | v39.6,21.79 42.42,21.79 43.81,20.4 U2.3 | 51.56,20.22 47.8,23.98 v41.83,23.98
  Bottom 0.102: U$3.D7 24.82,50.8 25.68,51.66 26.39,51.66 34.29,43.76 34.29,24.79 38.33,20.75 38.51,20.75 v38.53,20.73 v39.6,21.79 39.62,21.77 v41.83,23.98
SI  (via drill 0.25)
  Top 0.102: 36.75,21.16 36.85,21.26 42.14,21.26 42.77,20.62 | 36.75,21.16 35.71,20.12 35.71,19.79 U1.4 | 42.77,20.62 43.31,20.09 U2.4 | v44.83,20.65 50.37,20.65 50.93,20.09 50.93,19.79 U3.4 | v42.8,20.65 42.77,20.62 | v54.69,20.22 54.84,20.37 58.27,20.37 58.55,20.09 U4.4 | v53.62,21.29 51.26,21.29 v50.7,21.84 | 36.75,21.16 v36.63,21.29
  Bottom 0.102: v42.8,20.65 v44.83,20.65 46.02,21.84 v50.7,21.84 | v53.62,21.29 v54.69,20.22 | U$3.D8 19.68,47.52 25.07,42.14 25.07,33.22 36.63,21.67 v36.63,21.29
VCC  (via drill 0.25, 0.6)
  Top 0.102: v29.23,8.94 29.21,8.89 | v37.36,14.91 37.21,15.06 U1.15 | v44.81,14.91 U2.15 | v51.89,14.91 52.43,15.44 52.43,15.77 U3.15 | v60.05,14.91 U4.15
  Top 0.127: 29.21,8.89 C2.1
  Top 0.305: U$1.IN+ 2.31,6.73 13.97,6.73 15.88,4.83 U$3.5V-3 15.88,1.91 16.51,1.27 25.4,1.27 26.04,1.91 26.04,5.71 27.3,6.99 27.3,8.76 C2.1 | L1.P$1 v28.57,27.94
  Bottom 0.102: 28.65,10.92 28.65,9.53 v29.23,8.94 | 28.65,10.92 28.65,27.81 v28.57,27.94 | 28.65,10.92 35.87,10.92 36.17,11.23 36.17,11.91 37.36,13.11 v37.36,14.91 v44.81,14.91 v51.89,14.91 55.68,14.91 55.96,15.19 58.47,15.19 58.75,14.91 v60.05,14.91
  Bottom 0.305: v28.57,27.94 28.57,29.21 23.5,34.29 VDD.1
VDD  (via drill 0.25)
  Top 0.102: U4.19 61.06,18.26 61.06,17.78 U4.18 v61.92,17.78 | U4.9 57.05,17.3 U4.8 57.02,17.75 56.19,17.75 | U3.19 53.44,18.26 U3.18 53.47,17.75 56.19,17.75 | v56.19,17.78 56.19,17.75 | U3.9 49.43,17.3 49.43,17.78 U3.8 49.4,17.75 48.56,17.75 | U2.19 45.82,18.26 45.82,17.78 U2.18 45.85,17.75 v46.69,17.75 48.56,17.75 | U2.9 41.81,17.3 U2.8 41.78,17.75 v40.95,17.75 | U1.9 34.19,17.3 34.19,17.78 U1.8 v33.33,17.78 | U1.19 38.2,18.26 U1.18 38.23,17.8 v39.06,17.8 | v48.56,17.78 48.56,17.75 | v32.33,18.77 28.09,18.77 26.64,20.22 26.64,31.65 29.54,34.54 29.54,37.24 28.65,38.12 28.65,39.24 VDD.6
  Top 0.305: VDD.2 VDD.4 VDD.6
  Bottom 0.102: v61.92,17.78 v56.19,17.78 56.16,17.8 56.16,18.49 55.78,18.87 49.66,18.87 v48.56,17.78 | v46.69,17.75 v40.95,17.75 39.06,17.75 v39.06,17.8 39.04,17.78 v33.33,17.78 v32.33,18.77

### Text on the board
tPlace: vcc | ext | boost